# EAGLE design PICO_PROBE (EAGLE 9.6.2)
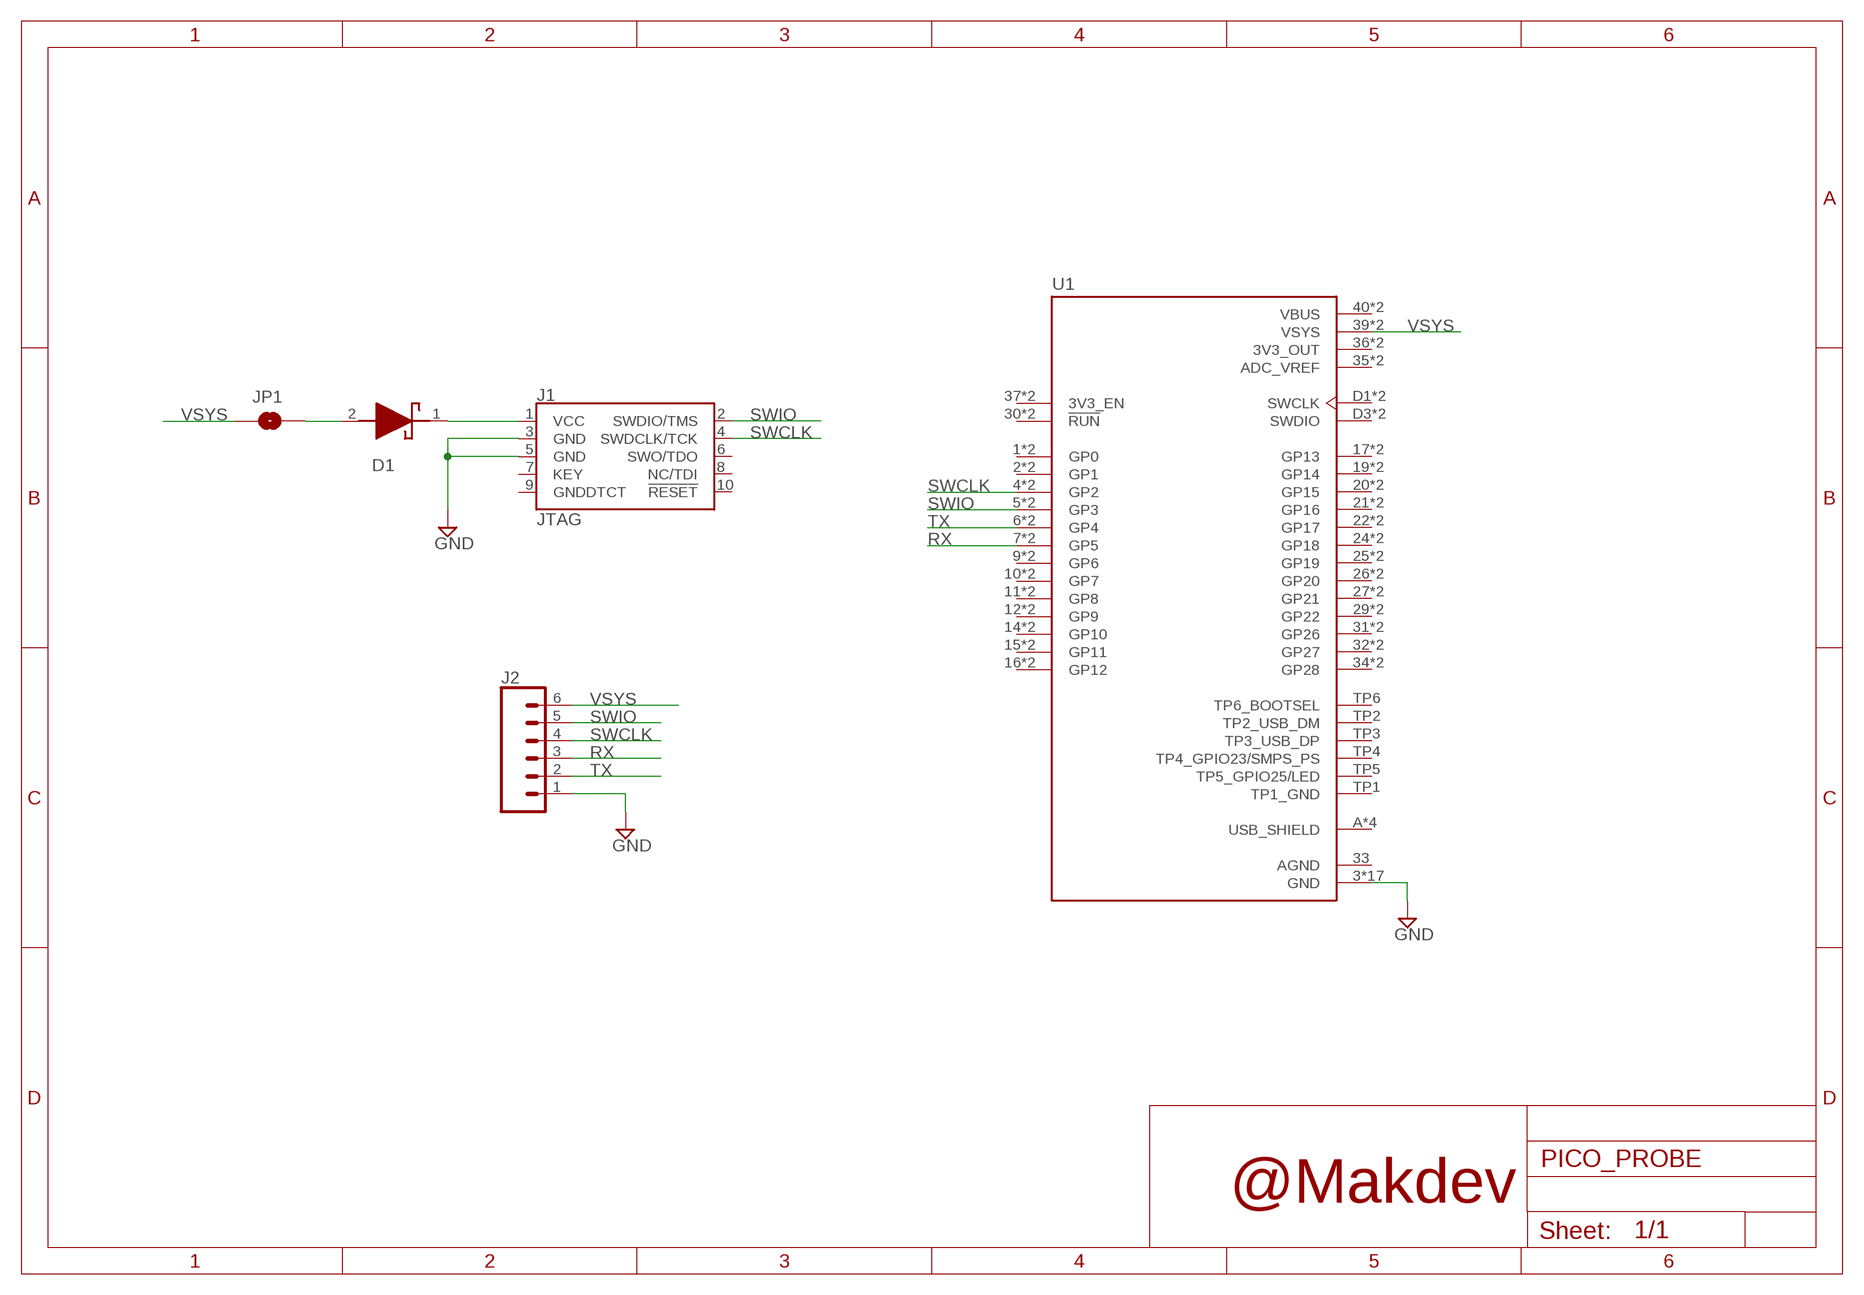
[diagram p0: schematic, sheet 1]

## Parts
D1  MBR120VLSFT1  [SODFL3616X98N]
J1  JTAG  CORTEX_JTAG_DEBUG_SMD  [2X5-SMD-1.27MM]
J2  CONN_06NO_SILK_FEMALE_PTH  [1X06_NO_SILK]
JP1  JUMPER-SMT_2_NO_NO-SILK  [SMT-JUMPER_2_NO_NO-SILK]
U1  SC0915  [MODULE_SC0915]

## Nets
GND: J1.3(GND) J1.5(GND) J2.1 U1.3(GND) U1.3_3(GND) U1.8(GND) U1.8_8(GND) U1.13(GND) U1.13_13(GND) U1.18(GND) U1.18_18(GND) U1.23(GND) U1.23_23(GND) U1.28(GND) U1.28_28(GND) U1.33_33(GND) U1.38(GND) U1.38_38(GND) U1.D2(GND) U1.D2_2(GND)
N$1: D1.2(A) JP1.2
N$2: D1.1(K) J1.1(VCC)
RX: J2.3 U1.7(GP5) U1.7_7(GP5)
SWCLK: J1.4(SWDCLK/TCK) J2.4 U1.4(GP2) U1.4_4(GP2)
SWIO: J1.2(SWDIO/TMS) J2.5 U1.5(GP3) U1.5_5(GP3)
TX: J2.2 U1.6(GP4) U1.6_6(GP4)
VSYS: J2.6 JP1.1 U1.39(VSYS) U1.39_39(VSYS)
Unconnected: J1.6(SWO/TDO) J1.7(KEY) J1.8(NC/TDI) J1.9(GNDDTCT) J1.10(!RESET) U1.1(GP0) U1.1_1(GP0) U1.2(GP1) U1.2_2(GP1) U1.9(GP6) U1.9_9(GP6) U1.10(GP7) U1.10_10(GP7) U1.11(GP8) U1.11_11(GP8) U1.12(GP9) U1.12_12(GP9) U1.14(GP10) U1.14_14(GP10) U1.15(GP11) U1.15_15(GP11) U1.16(GP12) U1.16_16(GP12) U1.17(GP13) U1.17_17(GP13) U1.19(GP14) U1.19_19(GP14) U1.20(GP15) U1.20_20(GP15) U1.21(GP16) U1.21_21(GP16) U1.22(GP17) U1.22_22(GP17) U1.24(GP18) U1.24_24(GP18) U1.25(GP19) U1.25_25(GP19) U1.26(GP20) U1.26_26(GP20) U1.27(GP21) U1.27_27(GP21) U1.29(GP22) U1.29_29(GP22) U1.30(!RUN) U1.30_30(!RUN) U1.31(GP26) U1.31_31(GP26) U1.32(GP27) U1.32_32(GP27) U1.34(GP28) U1.34_34(GP28) U1.37(3V3_EN) U1.37_37(3V3_EN) U1.D1(SWCLK) U1.D1_1(SWCLK) U1.D3(SWDIO) U1.D3_3(SWDIO) U1.TP2(TP2_USB_DM) U1.TP3(TP3_USB_DP) U1.TP4(TP4_GPIO23/SMPS_PS) U1.TP5(TP5_GPIO25/LED) U1.TP6(TP6_BOOTSEL)

## Notes on the sheet
- @Makdev

## Power pins joined to a net without a drawn wire
3V3_OUT: U1.36(3V3_OUT) U1.36_36(3V3_OUT)
ADC_VREF: U1.35(ADC_VREF) U1.35_35(ADC_VREF)
AGND: U1.33(AGND)
TP1_GND: U1.TP1(TP1_GND)
USB_SHIELD: U1.A(USB_SHIELD) U1.B(USB_SHIELD) U1.C(USB_SHIELD) U1.D(USB_SHIELD)
VBUS: U1.40(VBUS) U1.40_40(VBUS)

## Library data of the parts
D1 = SamacSys_Parts:MBR120VLSFT1: Schottky Diodes & Rectifiers 1A 20V Source: Datasheet <http://www.onsemi.com/pub/Collateral/MBR120VLSFT1-D.PDF>; DESCRIPTION: Schottky Diodes & Rectifiers 1A 20V; HEIGHT: 0.98mm; MANUFACTURER_NAME: ON Semiconductor; MANUFACTURER_PART_NUMBER: MBR120VLSFT1; MOUSER_PART_NUMBER: 863-MBR120VLSFT1; MOUSER_PRICE-STOCK: https://www.mouser.co.uk/ProductDetail/ON-Semiconductor/MBR120VLSFT1?qs=3JMERSakebqjSv5FO51FcA%3D%3D
J1 = SparkFun-Connectors:CORTEX_JTAG_DEBUG: Cortex Debug Connector - 10 pin Supports JTAG debug, Serial Wire debug, and Serial Wire Viewer. PTH and SMD connector options available. General Connector Information <http://infocenter.arm.com/help/topic/com.arm.doc.faqs/attached/13634/cortex_debug_connectors.pdf> Products: PTH Connector <http://www.digikey.com/product-detail/en/cnc-tech/3220-10-0100-00/1175-1627-ND/3883661> -via Digi-Key SparkFun PSoc <https://www.sparkfun.com/products/13229> SparkFun T <https://www.sparkfun.com/products/13810>; PROD_ID: CONN-14503
J2 = SparkFun-Connectors:CONN_06: Multi connection point. Often used as Generic Header-pin footprint for 0.1 inch spaced/style header connections On any of the 0.1 inch spaced packages, you can populate with these: Break Away Headers - Straight <https://www.sparkfun.com/products/116> (PRT-00116) Break Away Male Headers - Right Angle <https://www.sparkfun.com/products/553> (PRT-00553) Female Headers <https://www.sparkfun.com/products/115> (PRT-00115) Break Away Headers - Machine Pin <https://www.sparkfun.com/products/117> (PRT-00117) Break Away Female Headers - Swiss Machine Pin <https://www.sparkfun.com/products/743> (PRT-00743) Arduino Stackable Header - 6 Pin <https://www.sparkfun.com/products/9280> (PRT-09280) For SCREWTERMINALS and SPRING TERMINALS visit here: Screw Terimnals on SparkFun.com <https://www.sparkfun.com/search/results?term=Screw+Terminals> (5mm/3.5mm/2.54mm spacing) This device is also useful as a general connection point to wire up your design to another part of your project. Our various solder wires solder well into these plated through hole pads. Hook-Up Wire - Assortment (Stranded, 22 AWG) <https://www.sparkfun.com/products/11375> (PRT-11375) Hook-Up Wire - Assortment (Solid Core, 22 AWG) <https://www.sparkfun.com/products/11367> (PRT-11367) View the entire wire category on our website here <https://www.sparkfun.com/categories/141>; PROD_ID: CONN-08437
JP1 = SparkFun-Jumpers:JUMPER-SMT_2_NO: Normally open jumper This jumper has two pads in close proximity to each other. Apply solder to close the connection. Round pads are easier to solder for beginners, but are a lot larger. SparkFun Product that uses the round pads: SparkFun EL Sequencer <https://www.sparkfun.com/products/12781>
U1 = MyLib01:SC0915: RP2040 Raspberry Pi Pico - ARM Cortex-M0+ MCU 32-Bit Embedded Evaluation Board Check availability <https://pricing.snapeda.com/parts/SC0915/Raspberry%20Pi/view-part?ref=eda>; AVAILABILITY: In Stock; DESCRIPTION: RP2040 Raspberry Pi Pico series ARM® Cortex®-M0+ MCU 32-Bit Embedded Evaluation Board; MF: Raspberry Pi; MP: SC0915; PACKAGE: None; PRICE: None; PURCHASE-URL: https://pricing.snapeda.com/search/part/SC0915/?ref=eda

## Board
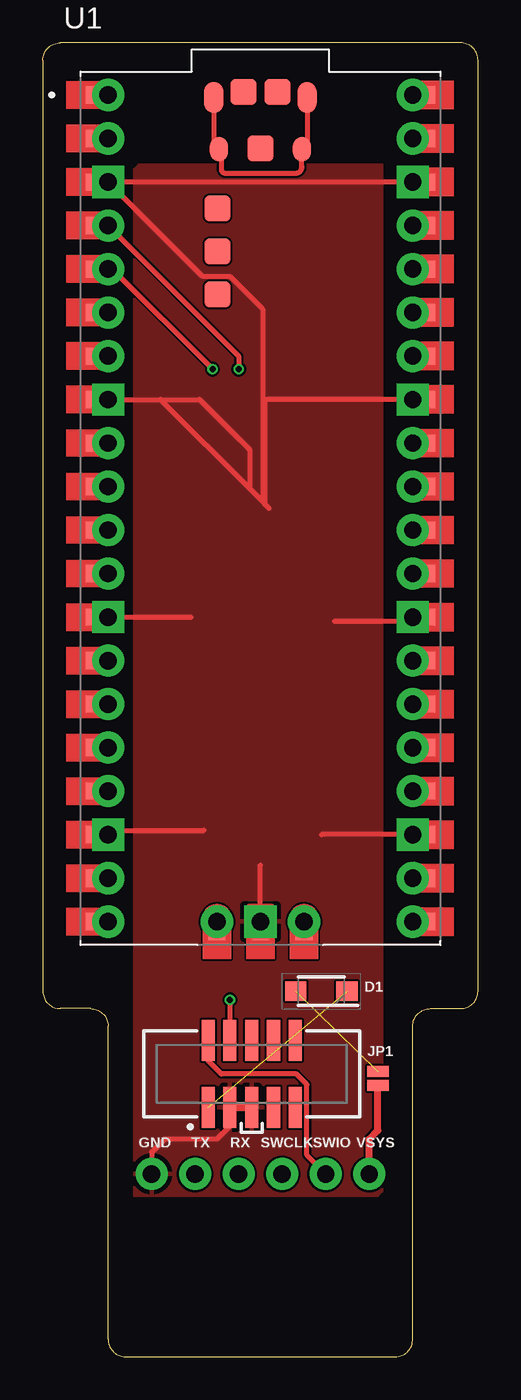
[diagram p1: board, top side]
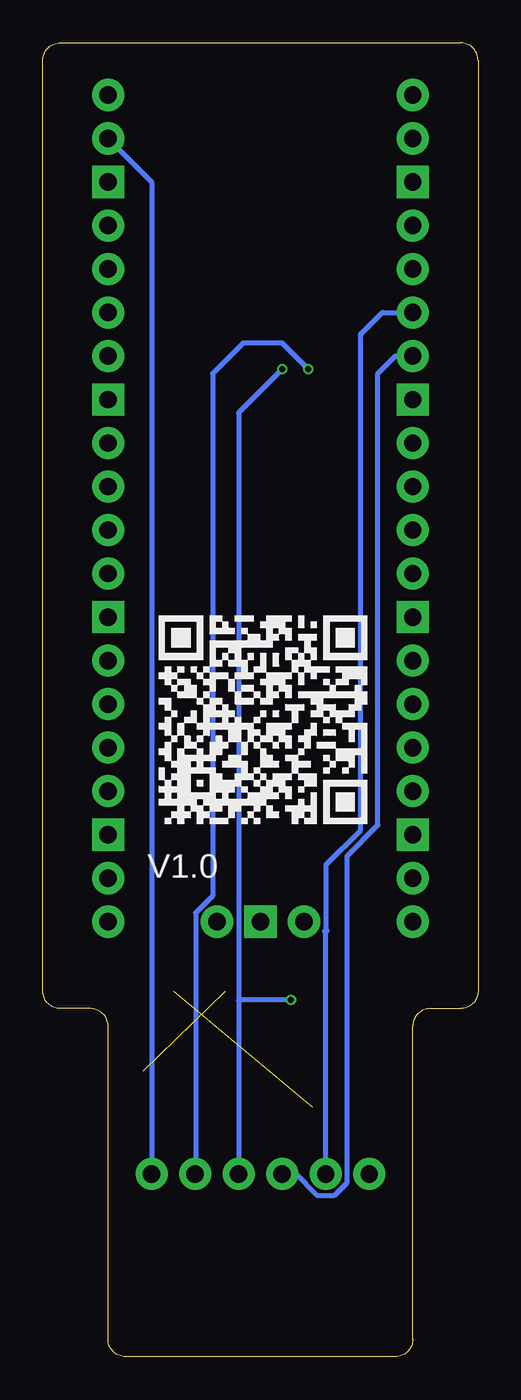
[diagram p2: board, bottom side, seen from below]

Size 25.4 x 76.71 mm. Coordinates in mm from the lower left corner, seen from the top.
Outline: 4.83,0 20.57,0 arc90 21.59,1.02 21.59,19.3 arc-90 22.61,20.32 24.38,20.32 arc90 25.4,21.34 25.4,75.69 arc90 24.38,76.71 1.02,76.71 arc90 0,75.69 0,21.34 arc90 1.02,20.32 2.79,20.32 arc-90 3.81,19.3 3.81,1.02 arc90 4.83,0
Copper layers (1*16): Top 0.035mm / dielectric 1.5mm / Bottom 0.035mm
Design rules "SparkFun-2-Layer-Minimum-JLCPCB": minimum track width 5mil, minimum drill 0.3mm, track to track 5mil, track to pad 5mil, pad to pad 5mil, via to via 5mil, smd to smd 5mil, copper to edge 7mil, drill to drill 7mil, minimum pad ring 5mil, minimum via ring 5mil, stop-mask expansion 2.5mil, vias tented up to drill 25mil, thermal gap 10mil

### Footprints (pad centres in the part's own frame; a part is rotated, then mirrored left to right if it is on the bottom)
SODFL3616X98N = smd 1.24 x 1.12: 1 -1.5,0; 2 1.5,0
2X5-SMD-1.27MM = smd 0.76 x 2.4: 1 2.54,1.95; 2 2.54,-1.95; 3 1.27,1.95; 4 1.27,-1.95; 5 0,1.95; 6 0,-1.95; 7 -1.27,1.95; 8 -1.27,-1.95; 9 -2.54,1.95; 10 -2.54,-1.95
1X06_NO_SILK = drill 1.016 pad 1.88: 1 0,0; 2 2.54,0; 3 5.08,0; 4 7.62,0; 5 10.16,0; 6 12.7,0
SMT-JUMPER_2_NO_NO-SILK = smd 0.635 x 1.27: 1 -0.406,0; 2 0.406,0
MODULE_SC0915 = smd 1 x 1: 1 -9.69,24.13; 2 -9.69,21.59; 3 -9.69,19.05; 4 -9.69,16.51; 5 -9.69,13.97; 6 -9.69,11.43; 7 -9.69,8.89; 8 -9.69,6.35; 9 -9.69,3.81; 10 -9.69,1.27; 11 -9.69,-1.27; 12 -9.69,-3.81; 13 -9.69,-6.35; 14 -9.69,-8.89; 15 -9.69,-11.43; 16 -9.69,-13.97; 17 -9.69,-16.51; 18 -9.69,-19.05; 19 -9.69,-21.59; 20 -9.69,-24.13; 21 9.69,-24.13; 22 9.69,-21.59; 23 9.69,-19.05; 24 9.69,-16.51; 25 9.69,-13.97; 26 9.69,-11.43; 27 9.69,-8.89; 28 9.69,-6.35; 29 9.69,-3.81; 30 9.69,-1.27; 31 9.69,1.27; 32 9.69,3.81; 33 9.69,6.35; 34 9.69,8.89; 35 9.69,11.43; 36 9.69,13.97; 37 9.69,16.51; 38 9.69,19.05; 39 9.69,21.59; 40 9.69,24.13; D1 -2.54,-24.7; D2 0,-24.7; D3 2.54,-24.7 | drill 1.016 pad 1.88: 1_1 -8.89,24.13; 2_2 -8.89,21.59; 4_4 -8.89,16.51; 5_5 -8.89,13.97; 6_6 -8.89,11.43; 7_7 -8.89,8.89; 9_9 -8.89,3.81; 10_10 -8.89,1.27; 11_11 -8.89,-1.27; 12_12 -8.89,-3.81; 14_14 -8.89,-8.89; 15_15 -8.89,-11.43; 16_16 -8.89,-13.97; 17_17 -8.89,-16.51; 19_19 -8.89,-21.59; 20_20 -8.89,-24.13; 21_21 8.89,-24.13; 22_22 8.89,-21.59; 24_24 8.89,-16.51; 25_25 8.89,-13.97; 26_26 8.89,-11.43; 27_27 8.89,-8.89; 29_29 8.89,-3.81; 30_30 8.89,-1.27; 31_31 8.89,1.27; 32_32 8.89,3.81; 34_34 8.89,8.89; 35_35 8.89,11.43; 36_36 8.89,13.97; 37_37 8.89,16.51; 39_39 8.89,21.59; 40_40 8.89,24.13; D1_1 -2.54,-24.13; D3_3 2.54,-24.13 | drill 1.016 pad 1.88 square: 3_3 -8.89,19.05; 8_8 -8.89,6.35; 13_13 -8.89,-6.35; 18_18 -8.89,-19.05; 23_23 8.89,-19.05; 28_28 8.89,-6.35; 33_33 8.89,6.35; 38_38 8.89,19.05; D2_2 0,-24.13 | smd 1.1 x 1.8: A -2.725,24; B 2.725,24 | smd 1.05 x 1.45: C -2.425,20.97; D 2.425,20.97 | smd 1.5 x 1.5: TP1 0,21; TP2 1,24.3; TP3 -1,24.3; TP4 -2.5,17.5; TP5 -2.5,15; TP6 -2.5,12.5

### Placement (x,y rotation side)
D1  16.26,21.34 180 top
J1  12.19,16.51 180 top
J2  6.35,10.67 0 top
JP1  19.56,16.26 90 top
U1  12.7,49.53 0 top
U$1  [PI-PICO-DEBUG-QRCODE]  6.1,30.73 0 top

### Tracks (layer width: path | path; a pad name or v marks a point on that pad's centre or on a via)
3V3_OUT
  Top 0.305: 23.5,63.37 23.37,63.5 22.61,63.5 U1.36 U1.36_36
ADC_VREF
  Top 0.152: 23.37,60.96 U1.35_35
  Top 0.305: U1.35 23.37,60.96
GND
  Top 0.305: J1.3 10.92,13.46 10.16,12.7 7.11,12.7 6.35,11.94 J2.1 | 8.64,43.18 U1.13_13 U1.13 | 17.02,42.93 22.14,42.93 arc90 U1.28 U1.28_28 | 16.26,30.48 U1.23_23 U1.23 | U1.D2 12.7,28.7 | 9.4,30.73 4.06,30.73 arc90 U1.18_18 U1.18 | U1.3_3 U1.38_38 U1.38 | U1.8_8 9.14,55.88 12.06,52.96 12.06,50.67 | U1.8 6.86,55.88 12.06,50.67 | 12.06,50.67 12.83,49.91 | 12.83,49.91 12.95,49.78 | 13.21,49.53 12.95,49.78 | U1.33_33 12.95,55.88 12.95,49.78 | U1.3_3 9.3,63.09 10.9,63.09 12.83,61.16 12.83,49.91 | U1.3_3 U1.3
  Top 0.406: J1.3 J1.5
  pour Top: 5.33,9.4 5.33,32.26 5.33,69.34 5.59,69.6 19.81,69.6 19.81,9.65 19.56,9.4
N$1  (1 unrouted)
N$2  (1 unrouted)
RX
  Top 0.305: U1.7_7 U1.7
  Bottom 0.305: J2.3 10.65,10.67 9.41,9.42 8.37,9.42 7.64,10.15 7.64,29.23 5.84,31.03 5.84,57.4 4.83,58.42 U1.7_7
SWCLK  (via drill 0.35)
  Top 0.305: v10.92,20.83 J1.4 | v11.43,57.66 11.43,58.42 U1.4_4 U1.4
  Bottom 0.305: v11.43,57.66 13.97,55.12 13.97,20.83 | 13.97,20.83 J2.4 | v10.92,20.83 13.97,20.83
SWIO  (via drill 0.35)
  Top 0.305: J2.5 15.42,11.76 15.42,15.89 14.79,16.51 10.41,16.51 9.65,17.27 J1.2 | v9.91,57.66 4.06,63.5 U1.5 U1.5_5
  Bottom 0.305: v9.91,57.66 11.43,59.18 13.72,59.18 15.49,57.4 15.49,26.91 16.48,25.92 16.48,10.69 J2.5
TX
  Top 0.305: U1.6_6 U1.6
  Bottom 0.305: J2.2 8.89,24.84 | 8.87,24.86 8.87,28.73 6.86,30.73 6.86,59.69 5.59,60.96 U1.6_6
  Bottom 0.406: 8.89,24.84 8.87,24.86
USB_SHIELD
  Top 0.305: U1.B 15.43,70.8 U1.D 15.12,69.48 arc-90 14.73,69.09 10.67,69.09 arc-90 10.41,69.34 10.41,70.36 arc90 U1.C 9.97,70.8 U1.A
VBUS
  Top 0.305: U1.40_40 U1.40
VSYS
  Top 0.305: U1.39_39 U1.39
  Top 0.406: J2.6 19.05,12.7 19.56,13.21 JP1.1
  Bottom 0.305: U1.39_39 19.05,68.58 J2.6

### Text on the board
tPlace: GND | TX | RX | SWCLK | SWIO | VSYS
bPlace: V1.0